# EAGLE design 211_MLL-Range-Extender-CAT5_v0063 (EAGLE 9.6.2)

## Sheet 1 of 2
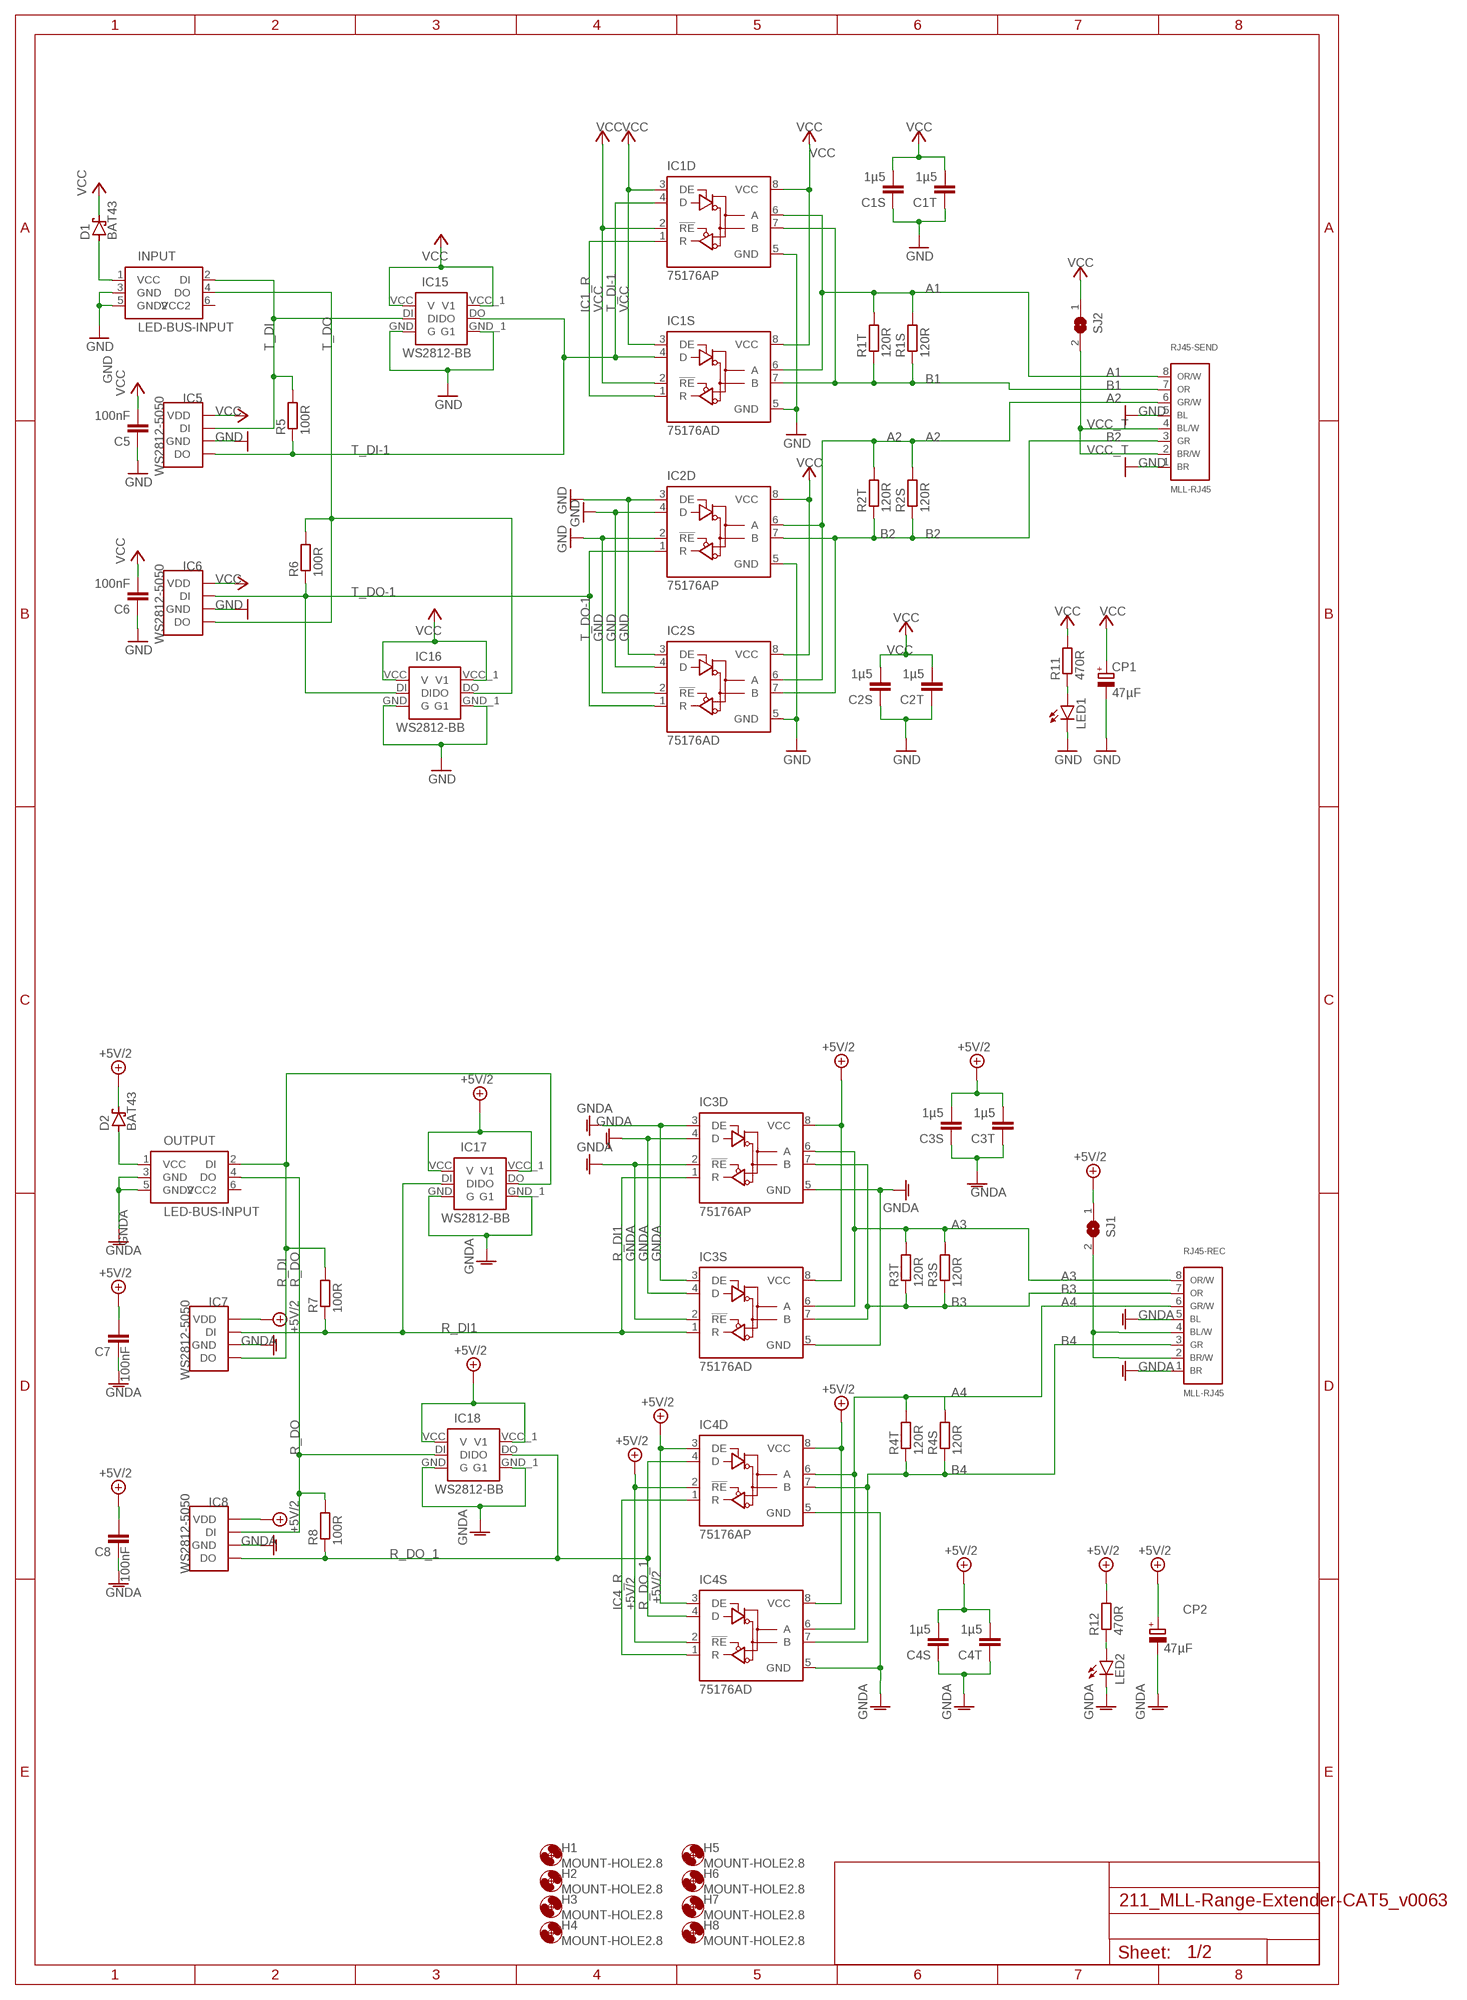
[diagram p0: schematic, sheet 1]

### Parts
C1S  1µ5  C-EUC1210  [C1210]
C1T  1µ5  C-EU050-025X075  [C050-025X075]
C2S  1µ5  C-EUC1210  [C1210]
C2T  1µ5  C-EU050-025X075  [C050-025X075]
C3S  1µ5  C-EUC1210  [C1210]
C3T  1µ5  C-EU050-025X075  [C050-025X075]
C4S  1µ5  C-EUC1210  [C1210]
C4T  1µ5  C-EU050-025X075  [C050-025X075]
C5  100nF  C-EU025-025X050  [C025-025X050]
C6  100nF  C-EU025-025X050  [C025-025X050]
C7  100nF  C-EU025-025X050  [C025-025X050]
C8  100nF  C-EU025-025X050  [C025-025X050]
CP1  47µF  CPOL-EUE2-5  [E2-5]
CP2  47µF  CPOL-EUE2-5  [E2-5]
D1  BAT43  BAT42  [DO35-10]
D2  BAT43  BAT42  [DO35-10]
H1  MOUNT-HOLE2.8  [2,8]
H2  MOUNT-HOLE2.8  [2,8]
H3  MOUNT-HOLE2.8  [2,8]
H4  MOUNT-HOLE2.8  [2,8]
H5  MOUNT-HOLE2.8  [2,8]
H6  MOUNT-HOLE2.8  [2,8]
H7  MOUNT-HOLE2.8  [2,8]
H8  MOUNT-HOLE2.8  [2,8]
IC1D  75176AP  [DIL08]
IC1S  75176AD  [D_R-PDSO-G8]
IC2D  75176AP  [DIL08]
IC2S  75176AD  [D_R-PDSO-G8]
IC3D  75176AP  [DIL08]
IC3S  75176AD  [D_R-PDSO-G8]
IC4D  75176AP  [DIL08]
IC4S  75176AD  [D_R-PDSO-G8]
IC5  WS2812-5050  [5050]
IC6  WS2812-5050  [5050]
IC7  WS2812-5050  [5050]
IC8  WS2812-5050  [5050]
IC15  WS2812-BB  [WS2812B-PCB2]
IC16  WS2812-BB  [WS2812B-PCB2]
IC17  WS2812-BB  [WS2812B-PCB2]
IC18  WS2812-BB  [WS2812B-PCB2]
INPUT  LED-BUS-INPUT  [IDC6]
LED1  LED3MM  [LED3MM]
LED2  LED3MM  [LED3MM]
OUTPUT  LED-BUS-INPUT  [IDC6]
R1S  120R  R-EU_R1210  [R1210]
R1T  120R  R-EU_0207/10  [0207/10]
R2S  120R  R-EU_R1210  [R1210]
R2T  120R  R-EU_0207/10  [0207/10]
R3S  120R  R-EU_R1210  [R1210]
R3T  120R  R-EU_0207/10  [0207/10]
R4S  120R  R-EU_R1210  [R1210]
R4T  120R  R-EU_0207/10  [0207/10]
R5  100R  R-EU_0207/10  [0207/10]
R6  100R  R-EU_0207/10  [0207/10]
R7  100R  R-EU_0207/10  [0207/10]
R8  100R  R-EU_0207/10  [0207/10]
R11  470R  R-EU_0207/10  [0207/10]
R12  470R  R-EU_0207/10  [0207/10]
RJ45-REC  MLL-RJ45  [RJ45_U]
RJ45-SEND  MLL-RJ45  [RJ45_U]
SJ1  SJ  [SJ]
SJ2  SJ  [SJ]

### Nets
+5V/2: C3S.2 C3T.2 C4S.2 C4T.2 C7.2 C8.2 CP2.+ D2.C IC3D.8(VCC) IC3S.8(VCC) IC4D.2(!RE) IC4D.3(DE) IC4D.8(VCC) IC4S.2(!RE) IC4S.3(DE) IC4S.8(VCC) IC7.VCC(VDD) IC8.VCC(VDD) IC17.VCC(V) IC17.VCC_1(V1) IC18.VCC(V) IC18.VCC_1(V1) R12.2 SJ1.1
A1: IC1D.6(A) IC1S.6(A) R1S.2 R1T.2 RJ45-SEND.8(ORANGE/WHITE)
A2: IC2D.6(A) IC2S.6(A) R2S.2 R2T.2 RJ45-SEND.6(GREEN/WHITE)
A3: IC3D.6(A) IC3S.6(A) R3S.2 R3T.2 RJ45-REC.8(ORANGE/WHITE)
A4: IC4D.6(A) IC4S.6(A) R4S.2 R4T.2 RJ45-REC.6(GREEN/WHITE)
B1: IC1D.7(B) IC1S.7(B) R1S.1 R1T.1 RJ45-SEND.7(OPRANGE)
B2: IC2D.7(B) IC2S.7(B) R2S.1 R2T.1 RJ45-SEND.3(GREEN)
B3: IC3D.7(B) IC3S.7(B) R3S.1 R3T.1 RJ45-REC.7(OPRANGE)
B4: IC4D.7(B) IC4S.7(B) R4S.1 R4T.1 RJ45-REC.3(GREEN)
GND: C1S.1 C1T.1 C2S.1 C2T.1 C5.1 C6.1 CP1.- IC1D.5(GND) IC1S.5(GND) IC2D.2(!RE) IC2D.3(DE) IC2D.4(D) IC2D.5(GND) IC2S.2(!RE) IC2S.3(DE) IC2S.4(D) IC2S.5(GND) IC5.GND IC6.GND IC15.GND(G) IC15.GND_1(G1) IC16.GND(G) IC16.GND_1(G1) INPUT.3(GND) INPUT.5(GND2) LED1.K(C) RJ45-SEND.1(BROWN) RJ45-SEND.5(BLUE)
GNDA: C3S.1 C3T.1 C4S.1 C4T.1 C7.1 C8.1 CP2.- IC3D.2(!RE) IC3D.3(DE) IC3D.4(D) IC3D.5(GND) IC3S.2(!RE) IC3S.3(DE) IC3S.4(D) IC3S.5(GND) IC4D.5(GND) IC4S.5(GND) IC7.GND IC8.GND IC17.GND(G) IC17.GND_1(G1) IC18.GND(G) IC18.GND_1(G1) LED2.K(C) OUTPUT.3(GND) OUTPUT.5(GND2) RJ45-REC.1(BROWN) RJ45-REC.5(BLUE)
IC1_R: IC1D.1(R) IC1S.1(R)
IC4_R: IC4D.1(R) IC4S.1(R)
LED1-R: LED1.A R11.1
LED2_R: LED2.A R12.1
N$1: D1.A INPUT.1(VCC)
R_DI: IC7.DO IC17.DO OUTPUT.2(DI) R7.2
R_DI1: IC3D.1(R) IC3S.1(R) IC7.DI IC17.DI R7.1
R_DO: IC8.DI IC18.DI OUTPUT.4(DO) R8.2
R_DO_1: IC4D.4(D) IC4S.4(D) IC8.DO IC18.DO R8.1
T_DI: IC5.DI IC15.DI INPUT.2(DI) R5.2
T_DI-1: IC1D.4(D) IC1S.4(D) IC5.DO IC15.DO R5.1
T_DO: IC6.DO IC16.DO INPUT.4(DO) R6.2
T_DO-1: IC2D.1(R) IC2S.1(R) IC6.DI IC16.DI R6.1
VCC: C1S.2 C1T.2 C2S.2 C2T.2 C5.2 C6.2 CP1.+ D1.C IC1D.2(!RE) IC1D.3(DE) IC1D.8(VCC) IC1S.2(!RE) IC1S.3(DE) IC1S.8(VCC) IC2D.8(VCC) IC2S.8(VCC) IC5.VCC(VDD) IC6.VCC(VDD) IC15.VCC(V) IC15.VCC_1(V1) IC16.VCC(V) IC16.VCC_1(V1) R11.2 SJ2.1
VCC_T: RJ45-SEND.2(BROWN/WHITE) RJ45-SEND.4(BLUE/WHITE) SJ2.2
VDD_IN: D2.A OUTPUT.1(VCC)
VDD_T: RJ45-REC.2(BROWN/WHITE) RJ45-REC.4(BLUE/WHITE) SJ1.2

## Sheet 2 of 2
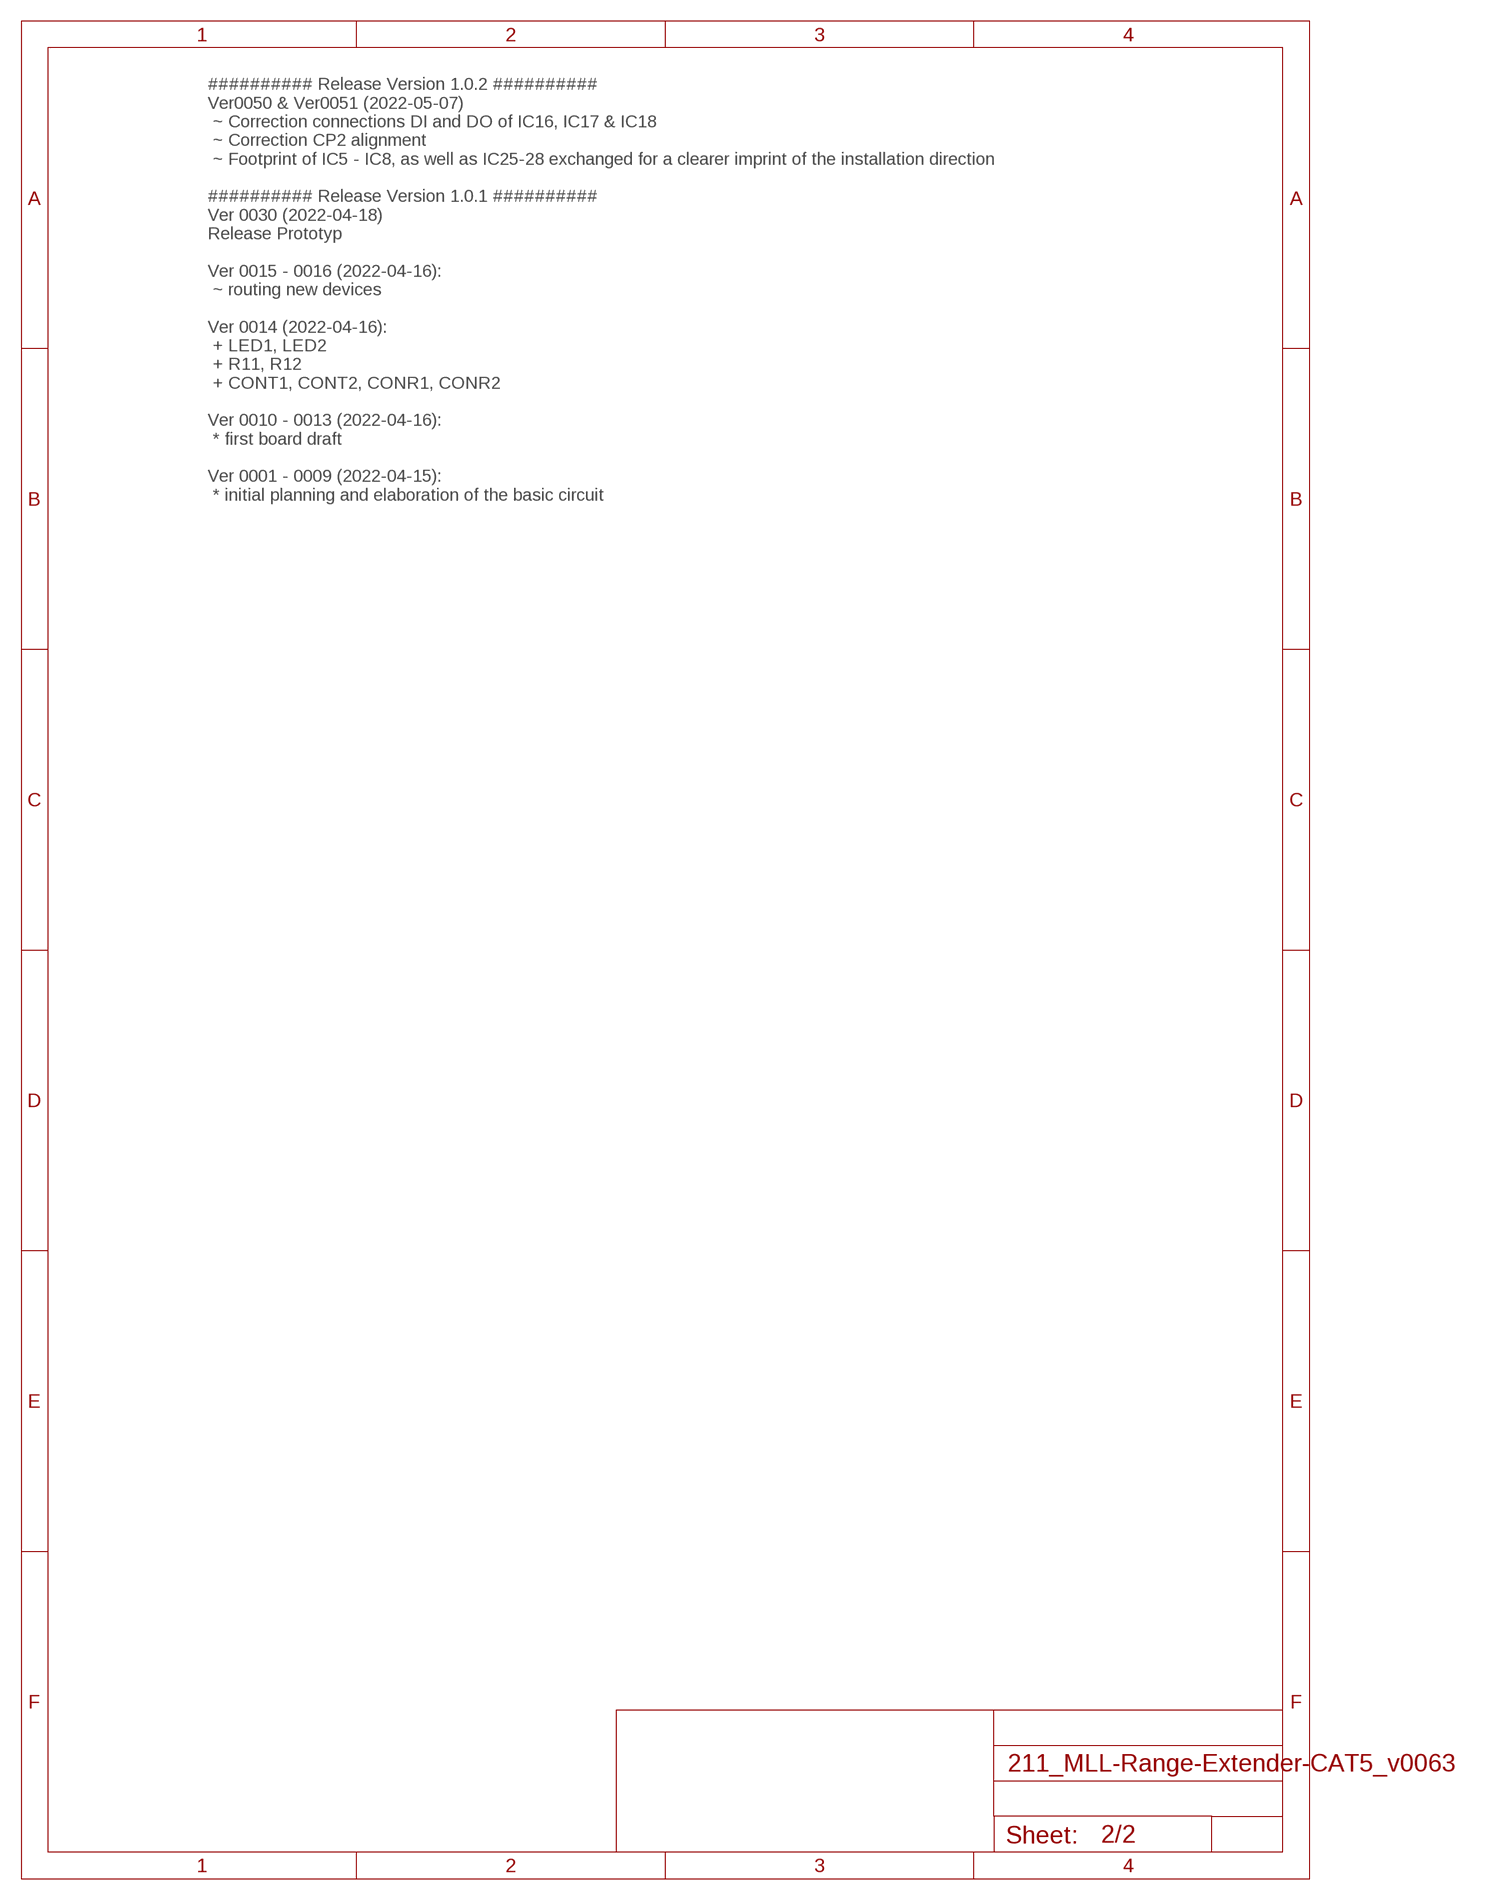
[diagram p1: schematic, sheet 2]

### Notes on the sheet
- ########## Release Version 1.0.2 ##########
  Ver0050 & Ver0051 (2022-05-07)
   ~ Correction connections DI and DO of IC16, IC17 & IC18
   ~ Correction CP2 alignment
   ~ Footprint of IC5 - IC8, as well as IC25-28 exchanged for a clearer imprint of the installation direction
  
  ########## Release Version 1.0.1 ##########
  Ver 0030 (2022-04-18)
  Release Prototyp
  
  Ver 0015 - 0016 (2022-04-16):
   ~ routing new devices
  
  Ver 0014 (2022-04-16):
   + LED1, LED2
   + R11, R12
   + CONT1, CONT2, CONR1, CONR2
  
  Ver 0010 - 0013 (2022-04-16):
   * first board draft
  
  Ver 0001 - 0009 (2022-04-15):
   * initial planning and elaboration of the basic circuit

## Power pins joined to a net without a drawn wire
VCC2: INPUT.6(VCC2)
VDD: OUTPUT.6(VCC2)

## Library data of the parts
C1S C1T C2S C2T C3S C3T C4S C4T C5-C8 = rcl:C-EU: CAPACITOR, European symbol; SPICEPREFIX: C
CP1 CP2 = rcl:CPOL-EU: POLARIZED CAPACITOR, European symbol; SPICEPREFIX: C
D1 D2 = diode:BAT42: DIODE barrier diode
H1-H8 = holes:MOUNT-HOLE: MOUNTING HOLE with drill center marker
IC1D IC1S IC2D IC2S IC3D IC3S IC4D IC4S = 751xx:75176A: DIFFERENTIAL BUS TRANSCEIVER Source: http://focus.ti.com/lit/ds/symlink/sn75176a.pdf
IC5-IC8 = HD_ICs:WS2812-
IC15-IC18 = HD_ICs:WS2812-BB
INPUT OUTPUT = HD_Kontakte:LED-BUS-INPUT
LED1 LED2 = led:LED: LED OSRAM: - CHIPLED LG R971, LG N971, LY N971, LG Q971, LY Q971, LO R971, LY R971 LH N974, LH R974 LS Q976, LO Q976, LY Q976 LO Q996 - Hyper CHIPLED LW Q18S LB Q993, LB Q99A, LB R99A - SideLED LS A670, LO A670, LY A670, LG A670, LP A670 LB A673, LV A673, LT A673, LW A673 LH A674 LY A675 LS A676, LA A676, LO A676, LY A676, LW A676 LS A679, LY A679, LG A679 - Hyper Micro SIDELED® LS Y876, LA Y876, LO Y876, LY Y876 LT Y87S - SmartLED LW L88C, LW L88S LB L89C, LB L89S, LG L890 LS L89K, LO L89K, LY L89K LS L896, LA L896, LO L896, LY L896 - TOPLED LS T670, LO T670, LY T670, LG T670, LP T670 LSG T670, LSP T670, LSY T670, LOP T670, LYG T670 LG T671, LOG T671, LSG T671 LB T673, LV T673, LT T673, LW T673 LH T674 LS T676, LA T676, LO T676, LY T676, LB T676, LH T676, LSB T676, LW T676 LB T67C, LV T67C, LT T67C, LS T67K, LO T67K, LY T67K, LW E67C LS E67B, LA E67B, LO E67B, LY E67B, LB E67C, LV E67C, LT E67C LW T67C LS T679, LY T679, LG T679 LS T770, LO T770, LY T770, LG T770, LP T770 LB T773, LV T773, LT T773, LW T773 LH T774 LS E675, LA E675, LY E675, LS T675 LS T776, LA T776, LO T776, LY T776, LB T776 LHGB T686 LT T68C, LB T68C - Hyper Mini TOPLED® LB M676 - Mini TOPLED Santana® LG M470 LS M47K, LO M47K, LY M47K Source: http://www.osram.convergy.de LUXEON: - LUMILED® LXK2-PW12-R00, LXK2-PW12-S00, LXK2-PW14-U00, LXK2-PW14-V00 LXK2-PM12-R00, LXK2-PM12-S00, LXK2-PM14-U00 LXK2-PE12-Q00, LXK2-PE12-R00, LXK2-PE12-S00, LXK2-PE14-T00, LXK2-PE14-U00 LXK2-PB12-K00, LXK2-PB12-L00, LXK2-PB12-M00, LXK2-PB14-N00, LXK2-PB14-P00, LXK2-PB14-Q00 LXK2-PR12-L00, LXK2-PR12-M00, LXK2-PR14-Q00, LXK2-PR14-R00 LXK2-PD12-Q00, LXK2-PD12-R00, LXK2-PD12-S00 LXK2-PH12-R00, LXK2-PH12-S00 LXK2-PL12-P00, LXK2-PL12-Q00, LXK2-PL12-R00 Source: www.luxeon.com KINGBRIGHT: KA-3528ASYC Source: www.kingbright.com
R1S R1T R2S R2T R3S R3T R4S R4T R5-R8 R11 R12 = rcl:R-EU_: RESISTOR, European symbol; SPICEPREFIX: R
RJ45-REC RJ45-SEND = HD_Kontakte:MLL-RJ45
SJ1 SJ2 = jumper:SJ: SMD solder JUMPER

## Board
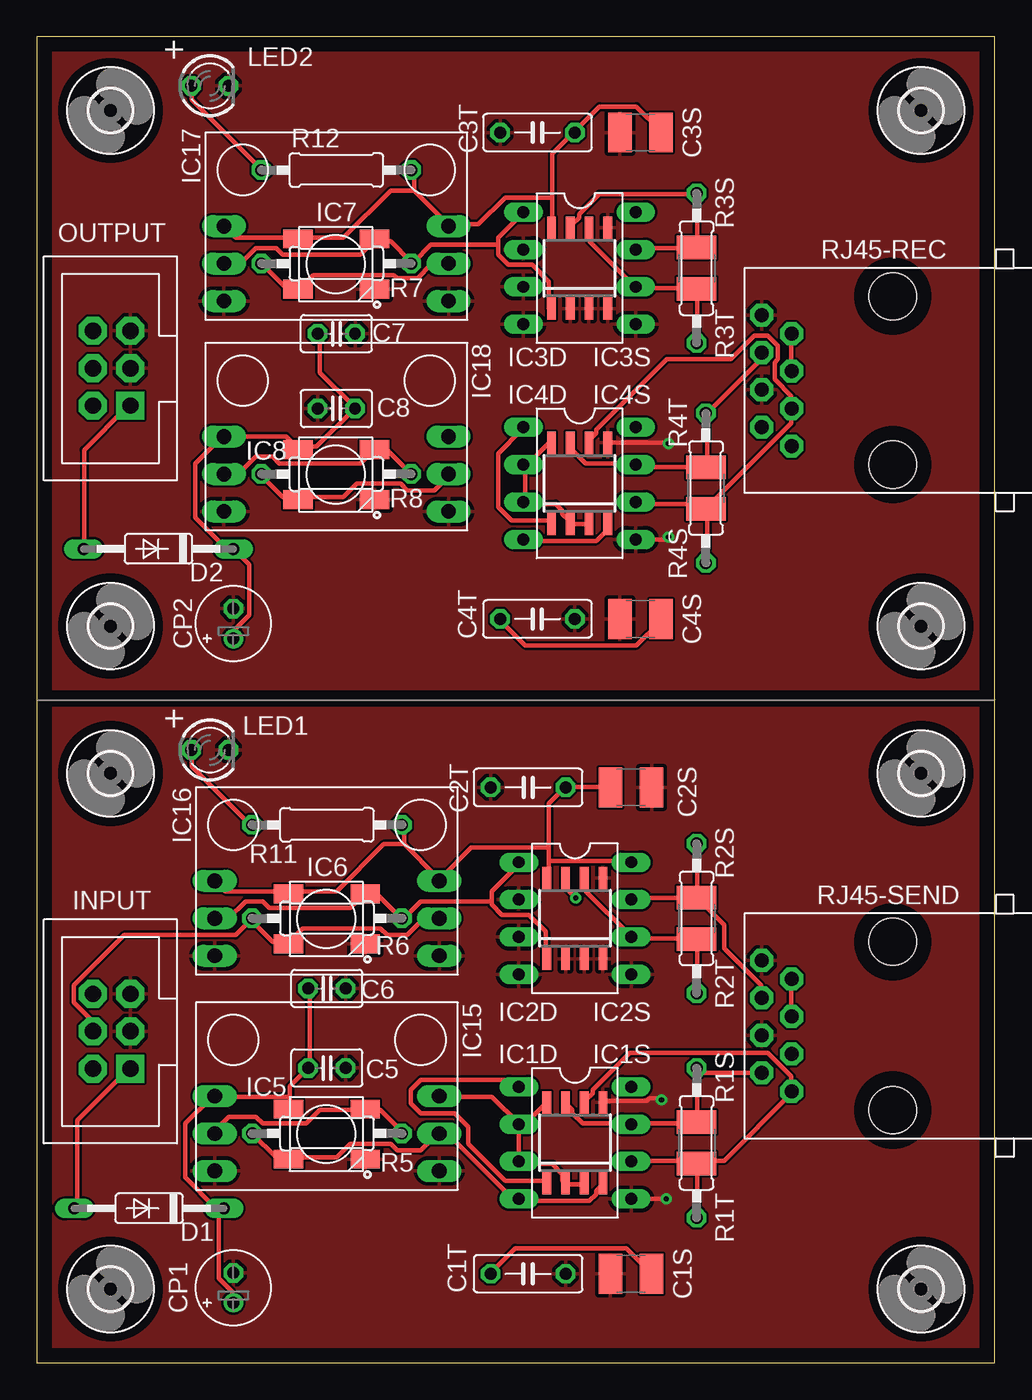
[diagram p2: board, top side]
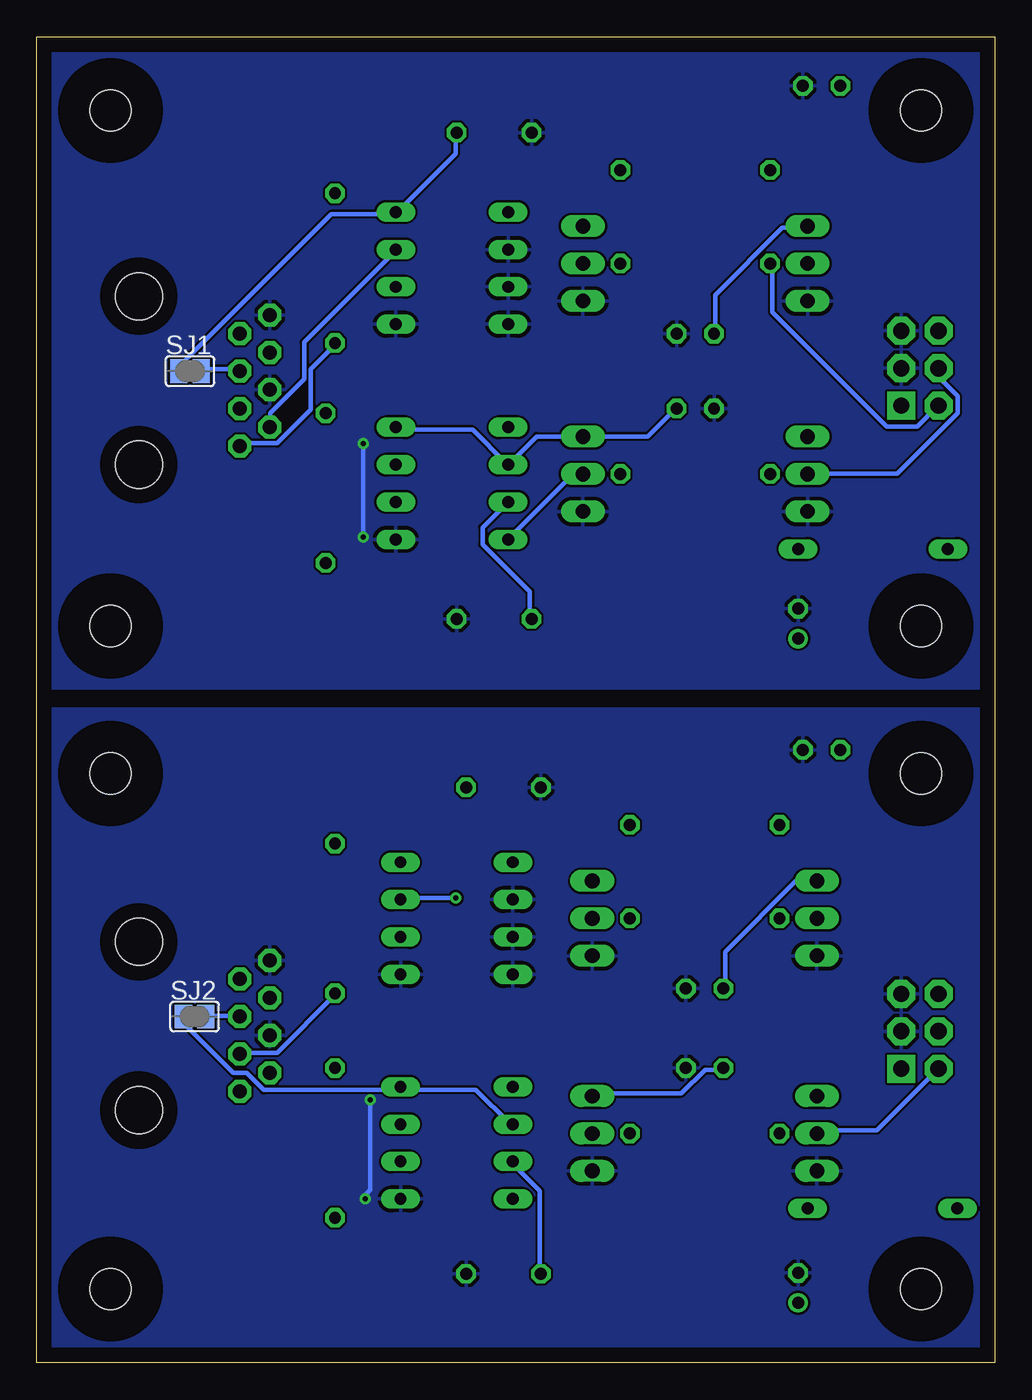
[diagram p3: board, bottom side, seen from below]

Size 65 x 90 mm. Coordinates in mm from the lower left corner, seen from the top.
Outline: 0,0 65,0 65,90 0,90 0,0
Copper layers (1*16): Top 0.035mm / dielectric 1.5mm / Bottom 0.035mm
Design rules "default *": minimum track width 12mil, minimum drill 0.35mm, track to track 6mil, track to pad 6mil, pad to pad 6mil, via to via 6mil, smd to smd 6mil, copper to edge 40mil, drill to drill 6mil, minimum pad ring 10mil, minimum via ring 8mil, stop-mask expansion 4mil, vias tented up to drill 16mil, thermal gap 10mil

### Footprints (pad centres in the part's own frame; a part is rotated, then mirrored left to right if it is on the bottom)
C1210 = smd 1.6 x 2.7: 1 -1.4,0; 2 1.4,0
C050-025X075 = drill 0.813 octagon: 1 -2.54,0; 2 2.54,0
C025-025X050 = drill 0.813 octagon: 1 -1.27,0; 2 1.27,0
E2-5 = drill 0.813 pad 1.27: + -1.016,0 | drill 0.813 pad 1.27 octagon: - 1.016,0
DO35-10 = drill 0.813 long: A 5.08,0; C -5.08,0
2,8 = hole 2.8: 0,0
DIL08 = drill 0.813 long: 1 -3.81,-3.81; 2 -1.27,-3.81; 3 1.27,-3.81; 4 3.81,-3.81; 5 3.81,3.81; 6 1.27,3.81; 7 -1.27,3.81; 8 -3.81,3.81
D_R-PDSO-G8 = smd 0.6 x 1.5: 1 -1.905,-2.75; 2 -0.635,-2.75; 3 0.635,-2.75; 4 1.905,-2.75; 5 1.905,2.75; 6 0.635,2.75; 7 -0.635,2.75; 8 -1.905,2.75
5050 = smd 2 x 1.27: DI 2.6,1.66; DO -2.6,-1.74; GND 2.6,-1.74; VCC -2.6,1.66
WS2812B-PCB2 = drill 1 long: DI -7.62,-2.54; DO 7.62,-2.54; GND -7.62,-5.08; GND_1 7.62,-5.08; VCC -7.62,0; VCC_1 7.62,0
IDC6 = drill 1.1 pad 1.9 square: 1 -2.54,-1.27 | drill 1.1 pad 1.9 octagon: 2 -2.54,1.27; 3 0,-1.27; 4 0,1.27; 5 2.54,-1.27; 6 2.54,1.27
LED3MM = drill 0.813 octagon: A -1.27,0; K 1.27,0
R1210 = smd 1.6 x 2.7: 1 -1.4,0; 2 1.4,0
0207/10 = drill 0.813 octagon: 1 -5.08,0; 2 5.08,0
RJ45_U = drill 0.95 pad 1.56 octagon: 1 19.39,3.175; 2 17.36,4.445; 3 19.39,5.715; 4 17.36,6.985; 5 19.39,8.255; 6 17.36,9.525; 7 19.39,10.795; 8 17.36,12.065 | hole 3.2: 10.5,1.905; 10.5,13.335
SJ = smd 1.168 x 1.6: 1 -0.762,0; 2 0.762,0

### Placement (x,y rotation side)
C1S  40.32,6.03 0 top
C1T  33.34,6.03 180 top
C2S  40.32,39.05 180 top
C2T  33.34,39.05 0 top
C3S  40.96,83.5 0 top
C3T  33.97,83.5 0 top
C4S  40.96,50.48 0 top
C4T  33.97,50.48 180 top
C5  19.68,20 180 top
C6  19.68,25.4 180 top
C7  20.32,69.85 180 top
C8  20.32,64.77 0 top
CP1  13.34,5.08 90 top
CP2  13.34,50.16 90 top
D1  7.62,10.48 180 top
D2  8.26,55.24 180 top
H1  5,5 0 top
H2  60,5 0 top
H3  5,40 0 top
H4  60,40 0 top
H5  5,50 0 top
H6  5,85 0 top
H7  60,50 0 top
H8  60,85 0 top
IC1D  36.51,14.92 270 top
IC1S  36.51,14.92 0 top
IC2D  36.51,30.16 270 top
IC2S  36.51,30.16 0 top
IC3D  36.83,74.3 270 top
IC3S  36.83,74.3 0 top
IC4D  36.83,59.69 270 top
IC4S  36.83,59.69 0 top
IC5  19.68,15.56 0 top
IC6  19.68,30.16 0 top
IC7  20.32,74.61 0 top
IC8  20.32,60.33 0 top
IC15  19.68,18.1 0 top
IC16  19.68,32.7 0 top
IC17  20.32,77.15 0 top
IC18  20.32,62.87 0 top
INPUT  5.08,22.5 90 top
LED1  11.75,41.59 0 top
LED2  11.75,86.68 0 top
OUTPUT  5.08,67.5 90 top
R1S  44.77,14.92 270 top
R1T  44.77,14.92 270 top
R2S  44.77,30.16 270 top
R2T  44.77,30.16 270 top
R3S  44.77,74.3 270 top
R3T  44.77,74.3 270 top
R4S  45.4,59.37 270 top
R4T  45.4,59.37 270 top
R5  19.68,15.56 0 top
R6  19.68,30.16 180 top
R7  20.32,74.61 180 top
R8  20.32,60.33 0 top
R11  19.68,36.51 0 top
R12  20.32,80.96 0 top
RJ45-REC  68.58,74.3 180 top
RJ45-SEND  68.58,30.48 180 top
SJ1  54.61,67.31 0 bottom
SJ2  54.29,23.5 0 bottom

### Tracks (layer width: path | path; a pad name or v marks a point on that pad's centre or on a via)
+5V/2
  Top 0.305: 33.15,60.81 34.75,62.41 IC4S.8 | 33.15,60.81 IC4D.2 33.15,60.81 | IC4S.3 37.26,56.92 36.35,56.92 IC4S.2 36.12,57.15 35.66,57.61 35.66,57.84 35.2,58.29 33.15,58.29 IC4D.3 33.15,58.52 33.15,60.81 | C4S.2 42.29,50.29 40.69,48.69 33.15,48.69 31.55,50.29 C4T.2 | CP2.+ 13.49,49.15 13.49,49.84 14.4,50.75 14.4,54.18 13.49,55.09 D2.C 13.26,55.32 12.8,55.32 10.74,57.38 10.74,61.04 12.57,62.87 IC18.VCC 12.8,62.87 16.92,62.87 17.6,62.18 IC8.VCC 17.83,62.18 18.97,62.18 21.49,64.69 C8.2 21.49,64.92 19.2,67.21 19.2,69.72 C7.2 | IC17.VCC 12.8,77.04 13.49,76.35 17.6,76.35 IC7.VCC 17.83,76.35 20.8,76.35 24,79.55 25.6,79.55 | 25.6,79.55 25.6,80.92 R12.2 | 25.6,79.55 27.89,77.27 IC17.VCC_1 28.12,77.27 29.95,77.27 31.77,79.1 34.98,79.1 | 34.98,79.1 34.98,82.07 36.35,83.44 C3T.2 36.58,83.67 38.18,85.27 40.69,85.27 42.29,83.67 C3S.2 | 34.98,79.1 34.98,77.27 IC3S.8
  Bottom 0.305: IC4D.8 40.46,63.32 35.43,63.32 33.15,61.04 IC4D.2 32.92,61.04 31.09,62.87 28.12,62.87 IC18.VCC_1 27.89,62.87 23.55,62.87 21.72,64.69 C8.2 | C4T.2 31.55,50.52 31.55,52.35 34.75,55.55 34.75,56.69 33.15,58.29 IC4D.3 | SJ1.1 55.32,67.44 54.86,67.89 54.86,68.12 45.03,77.95 40.69,77.95 IC3D.8 40.46,78.18 36.58,82.07 36.58,83.44 C3T.2 | C7.2 18.97,69.95 18.97,72.47 14.4,77.04 12.8,77.04 IC17.VCC
A1
  Top 0.305: R1T.2 44.81,10.06 44.81,13.49 R1S.2 | IC1D.6 40.46,13.72 44.58,13.72 R1S.2 | IC1S.6 37.26,17.83 37.72,18.29 37.72,18.52 40.23,21.03 49.61,21.03 51.21,19.43 51.21,18.52 RJ45-SEND.8 51.21,18.29 46.63,13.72 44.81,13.72 R1S.2
A2
  Top 0.305: IC2S.6 37.26,32.69 37.26,32 40.23,29.03 IC2D.6 40.46,28.8 44.58,28.8 R2S.2 44.81,28.57 44.81,25.15 R2T.2
  Bottom 0.305: RJ45-SEND.6 51.21,21.03 48.69,21.03 44.81,24.92 R2T.2
A3
  Top 0.305: IC3S.6 37.49,77.04 37.49,76.12 40.46,73.15 IC3D.6 40.69,72.92 44.58,72.92 R3S.2 44.81,72.69 44.81,69.27 R3T.2
  Bottom 0.305: RJ45-REC.8 51.21,62.41 48.69,62.41 46.41,64.69 46.41,67.44 44.81,69.04 R3T.2
A4
  Top 0.305: IC4D.6 40.69,58.29 45.03,58.29 45.26,58.06 R4S.2 | R4T.2 45.49,54.41 45.49,57.84 R4S.2 | IC4S.6 37.49,62.64 37.95,63.09 37.95,63.32 42.75,68.12 47.09,68.12 48.69,69.72 49.61,69.72 50.29,69.04 50.29,68.12 50.06,67.89 50.06,66.75 51.21,65.61 51.21,64.92 RJ45-REC.6 51.21,64.69 51.21,63.78 45.49,58.06 R4S.2
B1
  Top 0.305: IC1S.7 35.89,17.6 36.35,17.14 36.35,16.92 37.03,16.23 40.23,16.23 IC1D.7 40.46,16.23 44.58,16.23 R1S.1 44.81,16.46 44.81,19.66 | 44.81,19.66 44.81,19.89 R1T.1 44.81,19.66 | 44.81,19.66 49.15,19.66 RJ45-SEND.7
B2  (via drill 0.35)
  Top 0.305: v36.58,31.55 35.89,32.23 35.89,32.69 IC2S.7 | R2T.1 44.81,35.2 44.81,31.77 R2S.1 | RJ45-SEND.3 49.15,24.92 49.15,25.6 46.63,28.12 46.63,29.72 44.81,31.55 R2S.1 | IC2D.7 40.46,31.55 44.58,31.55 R2S.1
  Bottom 0.305: v36.58,31.55 40.23,31.55 IC2D.7
B3
  Top 0.305: IC3S.7 36.35,77.27 36.8,77.72 36.8,77.95 38.18,79.32 44.58,79.32 R3T.1 44.81,79.32 44.81,75.89 R3S.1 44.58,75.67 40.69,75.67 IC3D.7
  Bottom 0.305: RJ45-REC.7 49.15,63.55 49.15,64.47 46.86,66.75 46.86,69.27 40.69,75.44 IC3D.7
B4
  Top 0.305: IC4S.7 36.35,62.41 36.35,61.95 37.26,61.04 40.46,61.04 IC4D.7 40.69,60.81 45.26,60.81 R4S.1 45.49,60.81 45.49,64.24 R4T.1 45.49,64.47 49.15,68.12 49.15,68.58 RJ45-REC.3
GND  (via drill 0.35)
  Top 0.305: IC1S.5 38.51,17.77 41.38,17.77 41.55,17.94 42.39,17.94 v42.39,17.83 | v42.7,11.11 IC1D.5
  Bottom 0.305: v42.39,17.83 42.39,11.75 42.86,11.27 v42.7,11.11
  pour Bottom: 0,44.45 0,0 64.77,0 64.77,44.45
  pour Top: 0,44.45 0,0 64.77,0 64.77,44.45
GNDA  (via drill 0.35)
  Top 0.305: IC4S.5 42.6,62.44 42.7,62.55 v42.86,62.39 | v42.86,56.04 42.7,55.88 IC4D.5
  Bottom 0.305: v42.86,62.39 v42.86,56.04
  pour Bottom: 0,45.72 64.77,45.72 64.77,90.17 0,90.17
  pour Top: 0,90.17 0,45.72 64.77,45.72 64.77,90.17
IC1_R
  Top 0.305: IC1S.1 34.52,12.34 31.77,12.34 29.26,14.86 29.26,16 28.35,16.92 26.06,16.92 25.38,17.6 25.38,18.52 26.06,19.2 32.23,19.2 32.69,18.75 IC1D.1
IC4_R
  Top 0.305: IC4S.1 34.75,57.15 32.23,57.15 31.32,58.06 31.32,61.72 32.92,63.32 IC4D.1
LED1-R
  Top 0.305: LED1.A 10.52,41.38 10.52,40.46 14.4,36.58 R11.1
LED2_R
  Top 0.305: LED2.A 10.52,86.64 10.52,85.72 15.09,81.15 R12.1
N$1
  Top 0.305: D1.A 2.74,10.52 2.74,16.46 6.17,19.89 INPUT.1
R_DI
  Top 0.305: R7.2 15.32,74.52 16.92,72.92 17.6,72.92 IC7.DO 17.83,72.92 18.75,73.84 24.23,73.84 24.46,73.61 25.83,73.61 26.75,74.52 27.89,74.52 IC17.DO
  Bottom 0.305: OUTPUT.2 3.89,64.92 5.26,63.55 7.32,63.55 15.09,71.32 15.09,74.52 R7.2
R_DI1
  Top 0.305: 31.32,75.89 31.32,76.35 32.92,77.95 IC3D.1 | 31.32,75.89 31.32,75.21 32,74.52 33.6,74.52 34.75,73.38 34.75,71.55 IC3S.1 | IC17.DI 12.8,74.75 13.95,74.75 14.86,75.67 16.23,75.67 16.69,75.21 21.95,75.21 22.86,76.12 IC7.DI 23.09,76.12 24,76.12 25.38,74.75 R7.1 25.6,74.75 26.75,75.89 31.32,75.89
R_DO
  Top 0.305: R8.2 25.38,60.35 23.77,61.95 23.09,61.95 IC8.DI 22.86,61.95 21.95,61.04 16.46,61.04 16,61.49 14.86,61.49 13.72,60.35 12.8,60.35 IC18.DI
  Bottom 0.305: OUTPUT.4 3.66,67.44 3.66,66.75 2.52,65.61 2.52,64.47 6.63,60.35 12.57,60.35 IC18.DI
R_DO_1
  Top 0.305: R8.1 15.32,60.12 16.69,58.75 17.6,58.75 IC8.DO 17.83,58.75 20.8,58.75 21.72,59.66 24.69,59.66 25.15,59.21 26.98,59.21 27.89,60.12 IC18.DO | IC4S.4 38.63,56.92 38.63,56.46 37.95,55.78 33.15,55.78 IC4D.4
  Bottom 0.305: IC18.DO 28.12,60.12 28.8,60.12 32.92,56.01 IC4D.4
T_DI
  Top 0.305: R5.2 24.69,15.77 23.32,17.14 22.4,17.14 IC5.DI 22.17,17.14 19.2,17.14 18.29,16.23 15.32,16.23 14.86,16.69 13.03,16.69 12.12,15.77 IC15.DI
  Bottom 0.305: IC15.DI 11.89,15.77 8,15.77 3.89,19.89 INPUT.2
T_DI-1
  Top 0.305: R5.1 14.63,15.54 16.23,13.95 16.92,13.95 IC5.DO 17.14,13.95 20.34,13.95 21.26,14.86 24,14.86 24.46,14.4 26.06,14.4 27.2,15.54 IC15.DO 27.43,15.54 27.89,15.54 32.23,11.2 32.69,11.2 IC1D.4 32.92,10.97 37.49,10.97 37.95,11.43 37.95,11.66 38.41,12.12 IC1S.4
T_DO
  Top 0.305: IC16.DO 27.2,29.95 26.06,29.95 25.15,29.03 23.77,29.03 23.32,29.49 18.06,29.49 17.14,28.57 IC6.DO 16.92,28.57 16,28.57 14.63,29.95 R6.2 14.4,29.95 13.49,29.03 5.94,29.03 2.52,25.6 2.52,24.46 3.66,23.32 3.66,22.63 INPUT.4
T_DO-1
  Top 0.305: 30.86,31.32 30.86,32 32.69,33.83 IC2D.1 | 30.86,31.32 30.86,31.09 31.55,30.4 33.38,30.4 34.52,29.26 34.52,27.43 IC2S.1 | IC16.DI 12.12,30.18 13.03,30.18 14.17,31.32 15.32,31.32 15.77,30.86 21.26,30.86 22.17,31.77 IC6.DI 22.4,31.77 23.09,31.77 24.69,30.18 R6.1 24.92,30.18 26.06,31.32 30.86,31.32
VCC
  Top 0.305: 34.75,34.98 34.75,37.95 35.66,38.86 C2T.2 35.89,39.09 38.86,39.09 C2S.2 | 34.75,34.98 34.75,34.06 | 34.75,34.06 34.75,32.92 IC2S.8 | 34.75,34.06 40.23,34.06 IC2D.8 | IC16.VCC 12.12,32.69 12.8,32 16.92,32 IC6.VCC 17.14,32 20.34,32 23.55,35.2 24.92,35.2 | 24.92,35.2 24.92,36.35 R11.2 | 24.92,35.2 27.2,32.92 IC16.VCC_1 27.43,32.92 29.49,34.98 34.75,34.98 | CP1.+ 13.26,4.12 13.26,4.8 12.34,5.71 12.34,10.06 12.57,10.29 D1.C 12.57,10.52 12.12,10.52 10.06,12.57 10.06,16.23 11.89,18.06 IC15.VCC 12.12,18.06 17.14,18.06 | 17.14,18.06 17.14,18.75 18.29,19.89 C5.2 18.52,20.12 18.52,25.38 C6.2 | 17.14,18.06 17.14,17.37 IC5.VCC | IC1S.8 34.52,17.6 32.92,16 IC1D.2 | IC15.VCC_1 27.43,18.06 30.86,18.06 32.69,16.23 IC1D.2 | IC1S.3 37.03,12.12 35.89,12.12 IC1S.2 35.66,12.34 35.66,12.8 34.98,13.49 32.92,13.49 IC1D.3 32.69,13.72 32.69,16 IC1D.2 | C1S.2 41.6,6.17 40.01,7.77 32.46,7.77 30.86,6.17 C1T.2
  Bottom 0.305: SJ2.1 54.86,23.32 54.86,22.86 51.66,19.66 50.75,19.66 49.61,18.52 40.46,18.52 IC1D.8 40.23,18.52 35.2,18.52 32.92,16.23 IC1D.2 | C1T.2 30.86,6.17 30.86,11.66 32.69,13.49 IC1D.3 | C5.2 18.52,19.89 19.66,19.89 21.26,18.29 27.2,18.29 IC15.VCC_1 | IC16.VCC 12.12,32.69 13.49,32.69 18.29,27.89 18.29,25.6 C6.2
VCC_T
  Top 0.305: RJ45-SEND.2 51.21,25.83 51.21,23.55 RJ45-SEND.4
  Bottom 0.305: SJ2.2 53.49,23.55 51.44,23.55 RJ45-SEND.4
VDD_IN
  Top 0.305: D2.A 3.2,55.32 3.2,61.95 6.17,64.92 OUTPUT.1
VDD_T
  Top 0.305: RJ45-REC.2 51.21,69.72 51.21,67.44 RJ45-REC.4
  Bottom 0.305: SJ1.2 53.72,67.44 51.44,67.44 RJ45-REC.4

### Text on the board
tPlace: + | +